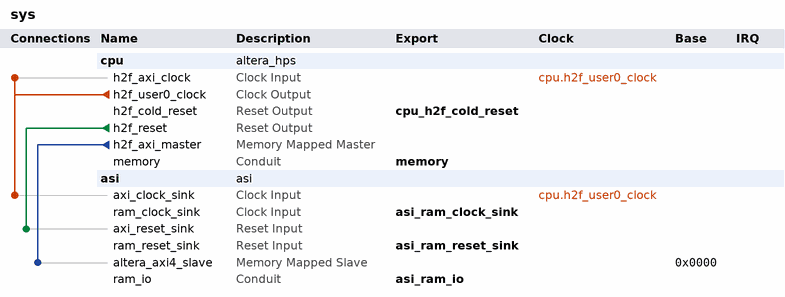
[diagram p0: system contents]
# Platform Designer (Qsys) system sys, Cyclone V 5CSEBA6U23I7
# Parameters at their usual value, and those the tool derives, are not listed.
package require -exact qsys 15.1
create_system sys
set_project_property DEVICE_FAMILY {Cyclone V}
set_project_property DEVICE 5CSEBA6U23I7

add_instance cpu altera_hps 15.1
set_instance_parameter_value cpu EMAC1_Mode N/A
set_instance_parameter_value cpu EMAC1_PinMuxing Unused
set_instance_parameter_value cpu F2SCLK_COLDRST_Enable false
set_instance_parameter_value cpu F2SCLK_DBGRST_Enable false
set_instance_parameter_value cpu F2SCLK_WARMRST_Enable false
set_instance_parameter_value cpu F2SINTERRUPT_Enable false
set_instance_parameter_value cpu F2S_Width 0
set_instance_parameter_value cpu FPGA_PERIPHERAL_OUTPUT_CLOCK_FREQ_EMAC0_GTX_CLK 125
set_instance_parameter_value cpu FPGA_PERIPHERAL_OUTPUT_CLOCK_FREQ_EMAC0_MD_CLK 2.5
set_instance_parameter_value cpu FPGA_PERIPHERAL_OUTPUT_CLOCK_FREQ_EMAC1_GTX_CLK 125
set_instance_parameter_value cpu FPGA_PERIPHERAL_OUTPUT_CLOCK_FREQ_EMAC1_MD_CLK 2.5
set_instance_parameter_value cpu HPS_PROTOCOL DDR3
set_instance_parameter_value cpu I2C0_Mode N/A
set_instance_parameter_value cpu I2C0_PinMuxing Unused
set_instance_parameter_value cpu I2C1_Mode N/A
set_instance_parameter_value cpu I2C1_PinMuxing Unused
set_instance_parameter_value cpu LWH2F_Enable false
set_instance_parameter_value cpu MEM_BANKADDR_WIDTH 3
set_instance_parameter_value cpu MEM_CLK_FREQ 300.0
set_instance_parameter_value cpu MEM_CLK_FREQ_MAX 400.0
set_instance_parameter_value cpu MEM_COL_ADDR_WIDTH 8
set_instance_parameter_value cpu MEM_DQ_WIDTH 8
set_instance_parameter_value cpu MEM_DRV_STR RZQ/6
set_instance_parameter_value cpu MEM_ROW_ADDR_WIDTH 12
set_instance_parameter_value cpu MEM_RTT_NOM {ODT Disabled}
set_instance_parameter_value cpu MEM_RTT_WR {Dynamic ODT off}
set_instance_parameter_value cpu MEM_TCL 7
set_instance_parameter_value cpu MEM_TFAW_NS 37.5
set_instance_parameter_value cpu MEM_TINIT_US 499
set_instance_parameter_value cpu MEM_TMRD_CK 3
set_instance_parameter_value cpu MEM_TRAS_NS 40.0
set_instance_parameter_value cpu MEM_TRCD_NS 15.0
set_instance_parameter_value cpu MEM_TREFI_US 7.0
set_instance_parameter_value cpu MEM_TRFC_NS 75.0
set_instance_parameter_value cpu MEM_TRP_NS 15.0
set_instance_parameter_value cpu MEM_TWTR 2
set_instance_parameter_value cpu MEM_VENDOR JEDEC
set_instance_parameter_value cpu MEM_WTCL 6
set_instance_parameter_value cpu MPU_EVENTS_Enable true
set_instance_parameter_value cpu QSPI_Mode N/A
set_instance_parameter_value cpu QSPI_PinMuxing Unused
set_instance_parameter_value cpu REF_CLK_FREQ 125.0
set_instance_parameter_value cpu S2FCLK_COLDRST_Enable true
set_instance_parameter_value cpu S2FCLK_USER0CLK_Enable true
set_instance_parameter_value cpu S2FCLK_USER2CLK 1
set_instance_parameter_value cpu S2F_Width 3
set_instance_parameter_value cpu SDIO_Mode N/A
set_instance_parameter_value cpu SDIO_PinMuxing Unused
set_instance_parameter_value cpu SPIM1_Mode N/A
set_instance_parameter_value cpu SPIM1_PinMuxing Unused
set_instance_parameter_value cpu STM_Enable false
set_instance_parameter_value cpu TIMING_BOARD_AC_SKEW 0.02
set_instance_parameter_value cpu TIMING_BOARD_AC_TO_CK_SKEW 0.0
set_instance_parameter_value cpu TIMING_BOARD_DQ_TO_DQS_SKEW 0.0
set_instance_parameter_value cpu TIMING_BOARD_MAX_CK_DELAY 0.6
set_instance_parameter_value cpu TIMING_BOARD_MAX_DQS_DELAY 0.6
set_instance_parameter_value cpu TIMING_BOARD_SKEW_BETWEEN_DQS 0.02
set_instance_parameter_value cpu TIMING_BOARD_SKEW_CKDQS_DIMM_MAX 0.01
set_instance_parameter_value cpu TIMING_BOARD_SKEW_CKDQS_DIMM_MIN -0.01
set_instance_parameter_value cpu TIMING_BOARD_SKEW_WITHIN_DQS 0.02
set_instance_parameter_value cpu TIMING_TDH 125
set_instance_parameter_value cpu TIMING_TDQSCK 400
set_instance_parameter_value cpu TIMING_TDQSQ 120
set_instance_parameter_value cpu TIMING_TDS 50
set_instance_parameter_value cpu TIMING_TIH 250
set_instance_parameter_value cpu TIMING_TIS 175
set_instance_parameter_value cpu TIMING_TQSH 0.38
set_instance_parameter_value cpu UART0_Mode N/A
set_instance_parameter_value cpu UART0_PinMuxing Unused
set_instance_parameter_value cpu USB1_Mode N/A
set_instance_parameter_value cpu USB1_PinMuxing Unused
set_instance_parameter_value cpu desired_cfg_clk_mhz 100.0
set_instance_parameter_value cpu desired_qspi_clk_mhz 400.0

add_instance asi asi 1.0
set_instance_parameter_value asi ASI_AD 16
set_instance_parameter_value asi ASI_ARB 0
set_instance_parameter_value asi ASI_BD 16
set_instance_parameter_value asi ASI_RD 16
set_instance_parameter_value asi ASI_WD 16
set_instance_parameter_value asi AXI_AW 10
set_instance_parameter_value asi AXI_BRESPW 2
set_instance_parameter_value asi AXI_BURSTW 2
set_instance_parameter_value asi AXI_DW 128
set_instance_parameter_value asi AXI_IW 12
set_instance_parameter_value asi AXI_LW 8
set_instance_parameter_value asi AXI_RRESPW 2
set_instance_parameter_value asi AXI_SW 3
set_instance_parameter_value asi SLV_WS 1

# connections
add_connection cpu.h2f_user0_clock asi.axi_clock_sink clock
add_connection cpu.h2f_user0_clock cpu.h2f_axi_clock clock
add_connection cpu.h2f_reset asi.axi_reset_sink reset
add_connection cpu.h2f_axi_master asi.altera_axi4_slave avalon
set_connection_parameter_value cpu.h2f_axi_master/asi.altera_axi4_slave baseAddress 0x0000

# exported interfaces
add_interface asi_ram_clock_sink clock sink
set_interface_property asi_ram_clock_sink EXPORT_OF asi.ram_clock_sink
add_interface asi_ram_io conduit end
set_interface_property asi_ram_io EXPORT_OF asi.ram_io
add_interface asi_ram_reset_sink reset sink
set_interface_property asi_ram_reset_sink EXPORT_OF asi.ram_reset_sink
add_interface cpu_h2f_cold_reset reset source
set_interface_property cpu_h2f_cold_reset EXPORT_OF cpu.h2f_cold_reset
add_interface memory conduit end
set_interface_property memory EXPORT_OF cpu.memory

set_interconnect_requirement {$system} qsys_mm.clockCrossingAdapter HANDSHAKE
set_interconnect_requirement {$system} qsys_mm.enableEccProtection FALSE
set_interconnect_requirement {$system} qsys_mm.insertDefaultSlave FALSE
set_interconnect_requirement {$system} qsys_mm.maxAdditionalLatency 1

save_system sys.qsys
